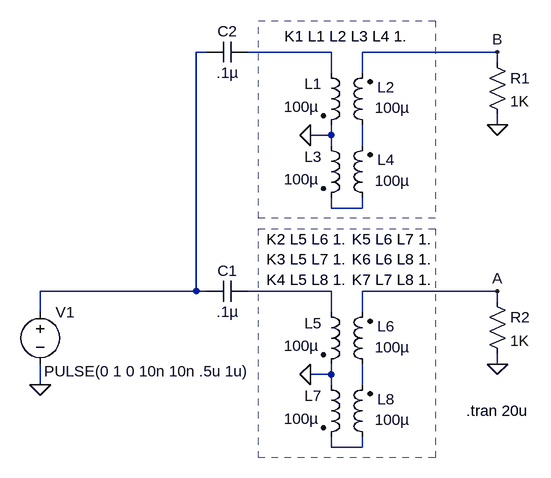
[diagram p0: schematic GoodXformer.asc]
GoodXformer.asc, the LTspice schematic file:
Version 4
SHEET 1 880 820
WIRE -688 560 -688 528
WIRE -688 672 -688 640
WIRE -448 528 -688 528
WIRE -448 528 -448 160
WIRE -432 160 -448 160
WIRE -432 528 -448 528
WIRE -240 160 -368 160
WIRE -240 192 -240 160
WIRE -240 288 -272 288
WIRE -240 288 -240 272
WIRE -240 304 -240 288
WIRE -240 400 -240 384
WIRE -240 528 -368 528
WIRE -240 560 -240 528
WIRE -240 656 -272 656
WIRE -240 656 -240 640
WIRE -240 672 -240 656
WIRE -240 768 -240 752
WIRE -192 192 -192 160
WIRE -192 304 -192 272
WIRE -192 400 -240 400
WIRE -192 400 -192 384
WIRE -192 560 -192 528
WIRE -192 672 -192 640
WIRE -192 768 -240 768
WIRE -192 768 -192 752
WIRE 16 160 -192 160
WIRE 16 176 16 160
WIRE 16 272 16 256
WIRE 16 528 -192 528
WIRE 16 544 16 528
WIRE 16 640 16 624
FLAG 16 272 0
FLAG 16 160 B
FLAG -272 288 0
FLAG -688 672 0
FLAG 16 640 0
FLAG 16 528 A
FLAG -272 656 0
SYMBOL ind2 -256 176 R0
WINDOW 0 2 33 Right 0
WINDOW 3 -3 68 Right 0
SYMATTR InstName L1
SYMATTR Value 100µ
SYMATTR Type ind
SYMBOL ind2 -176 288 R180
WINDOW 0 -7 74 Right 0
WINDOW 3 -3 42 Right 0
SYMATTR InstName L2
SYMATTR Value 100µ
SYMATTR Type ind
SYMBOL voltage -688 544 R0
WINDOW 3 6 107 Left 0
SYMATTR Value PULSE(0 1 0 10n 10n .5u 1u)
SYMATTR InstName V1
SYMBOL res 0 160 R0
SYMATTR InstName R1
SYMATTR Value 1K
SYMBOL ind2 -256 288 R0
WINDOW 0 2 33 Right 0
WINDOW 3 -3 68 Right 0
SYMATTR InstName L3
SYMATTR Value 100µ
SYMATTR Type ind
SYMBOL ind2 -176 400 R180
WINDOW 0 -7 74 Right 0
WINDOW 3 -3 42 Right 0
SYMATTR InstName L4
SYMATTR Value 100µ
SYMATTR Type ind
SYMBOL ind2 -256 544 R0
WINDOW 0 2 33 Right 0
WINDOW 3 -3 68 Right 0
SYMATTR InstName L5
SYMATTR Value 100µ
SYMATTR Type ind
SYMBOL ind2 -176 656 R180
WINDOW 0 -7 74 Right 0
WINDOW 3 -3 42 Right 0
SYMATTR InstName L6
SYMATTR Value 100µ
SYMATTR Type ind
SYMBOL res 0 528 R0
SYMATTR InstName R2
SYMATTR Value 1K
SYMBOL ind2 -256 656 R0
WINDOW 0 2 33 Right 0
WINDOW 3 -3 68 Right 0
SYMATTR InstName L7
SYMATTR Value 100µ
SYMATTR Type ind
SYMBOL ind2 -176 768 R180
WINDOW 0 -7 74 Right 0
WINDOW 3 -3 42 Right 0
SYMATTR InstName L8
SYMATTR Value 100µ
SYMATTR Type ind
SYMBOL cap -368 512 R90
WINDOW 0 0 32 VBottom 0
WINDOW 3 32 32 VTop 0
SYMATTR InstName C1
SYMATTR Value .1µ
SYMBOL cap -368 144 R90
WINDOW 0 0 32 VBottom 0
WINDOW 3 32 32 VTop 0
SYMATTR InstName C2
SYMATTR Value .1µ
TEXT -312 136 Left 0 !K1 L1 L2 L3 L4 1.
TEXT 64 712 Right 0 !.tran 20u
TEXT -216 448 Right 0 !K2 L5 L6 1.\nK3 L5 L7 1.\nK4 L5 L8 1.
TEXT -208 448 Left 0 !K5 L6 L7 1.\nK6 L6 L8 1.\nK7 L7 L8 1.
RECTANGLE Normal -80 416 -352 112 2
RECTANGLE Normal -80 784 -352 432 2

The netlist it stands for:
* GoodXformer.asc
L1 N002 0 100µ
L2 N006 B 100µ
V1 N001 0 PULSE(0 1 0 10n 10n .5u 1u)
R1 B 0 1K
L3 0 N003 100µ
L4 N003 N006 100µ
L5 N004 0 100µ
L6 N007 A 100µ
R2 A 0 1K
L7 0 N005 100µ
L8 N005 N007 100µ
C1 N004 N001 .1µ
C2 N002 N001 .1µ
K1 L1 L2 L3 L4 1.
.tran 20u
K2 L5 L6 1.
K3 L5 L7 1.
K4 L5 L8 1.
K5 L6 L7 1.
K6 L6 L8 1.
K7 L7 L8 1.
.backanno
.end